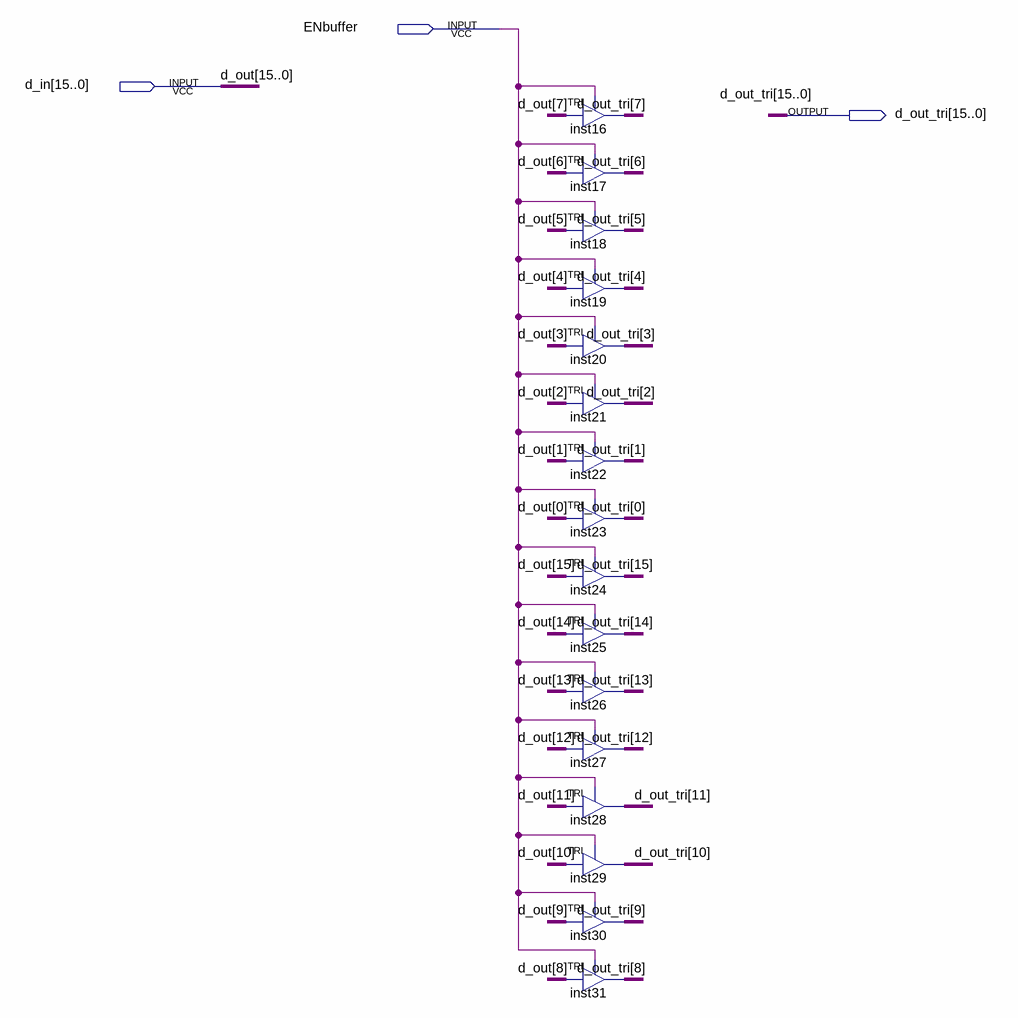
[diagram p0: schematic sheet]
// Quartus schematic Tri_Buffer_16b.bdf as structural Verilog: 16 symbols, 3 pins
module Tri_Buffer_16b (
  input  ENbuffer,
  input  [15:0] d_in,
  output [15:0] d_out_tri
);

  TRI inst16 (.IN(d_in[7]), .OE(ENbuffer), .OUT(d_out_tri[7]));
  TRI inst17 (.IN(d_in[6]), .OE(ENbuffer), .OUT(d_out_tri[6]));
  TRI inst18 (.IN(d_in[5]), .OE(ENbuffer), .OUT(d_out_tri[5]));
  TRI inst19 (.IN(d_in[4]), .OE(ENbuffer), .OUT(d_out_tri[4]));
  TRI inst20 (.IN(d_in[3]), .OE(ENbuffer), .OUT(d_out_tri[3]));
  TRI inst21 (.IN(d_in[2]), .OE(ENbuffer), .OUT(d_out_tri[2]));
  TRI inst22 (.IN(d_in[1]), .OE(ENbuffer), .OUT(d_out_tri[1]));
  TRI inst23 (.IN(d_in[0]), .OE(ENbuffer), .OUT(d_out_tri[0]));
  TRI inst24 (.IN(d_in[15]), .OE(ENbuffer), .OUT(d_out_tri[15]));
  TRI inst25 (.IN(d_in[14]), .OE(ENbuffer), .OUT(d_out_tri[14]));
  TRI inst26 (.IN(d_in[13]), .OE(ENbuffer), .OUT(d_out_tri[13]));
  TRI inst27 (.IN(d_in[12]), .OE(ENbuffer), .OUT(d_out_tri[12]));
  TRI inst28 (.IN(d_in[11]), .OE(ENbuffer), .OUT(d_out_tri[11]));
  TRI inst29 (.IN(d_in[10]), .OE(ENbuffer), .OUT(d_out_tri[10]));
  TRI inst30 (.IN(d_in[9]), .OE(ENbuffer), .OUT(d_out_tri[9]));
  TRI inst31 (.IN(d_in[8]), .OE(ENbuffer), .OUT(d_out_tri[8]));

  // Other names for the same wires on the sheet: d_out[15:0] = d_in
endmodule
